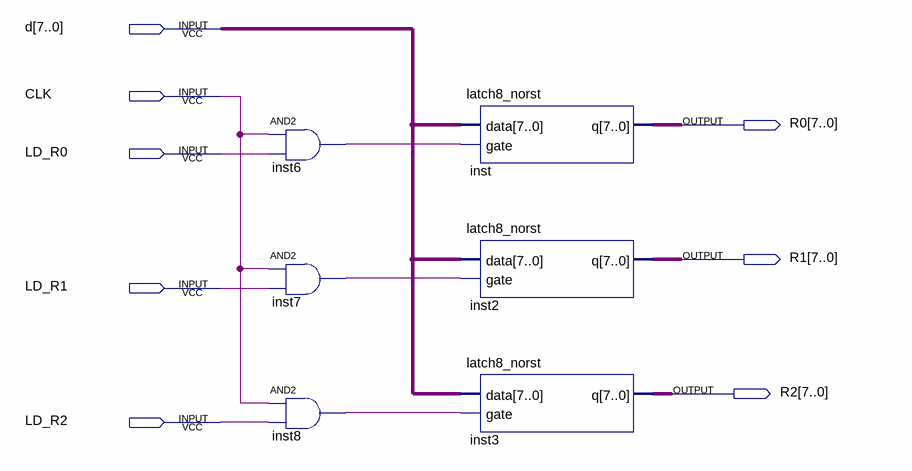
[diagram p0: schematic sheet]
// Quartus schematic REG0_2.bdf as structural Verilog: 6 symbols, 8 pins
module REG0_2 (
  input  [7:0] d,
  input  CLK,
  input  LD_R0,
  input  LD_R1,
  input  LD_R2,
  output [7:0] R0,
  output [7:0] R1,
  output [7:0] R2
);

  wire inst6_out, inst7_out, inst8_out;

  and inst6 (inst6_out, CLK, LD_R0);
  and inst7 (inst7_out, CLK, LD_R1);
  and inst8 (inst8_out, CLK, LD_R2);
  latch8_norst inst (.data(d), .gate(inst6_out), .q(R0));
  latch8_norst inst2 (.data(d), .gate(inst7_out), .q(R1));
  latch8_norst inst3 (.data(d), .gate(inst8_out), .q(R2));
endmodule
